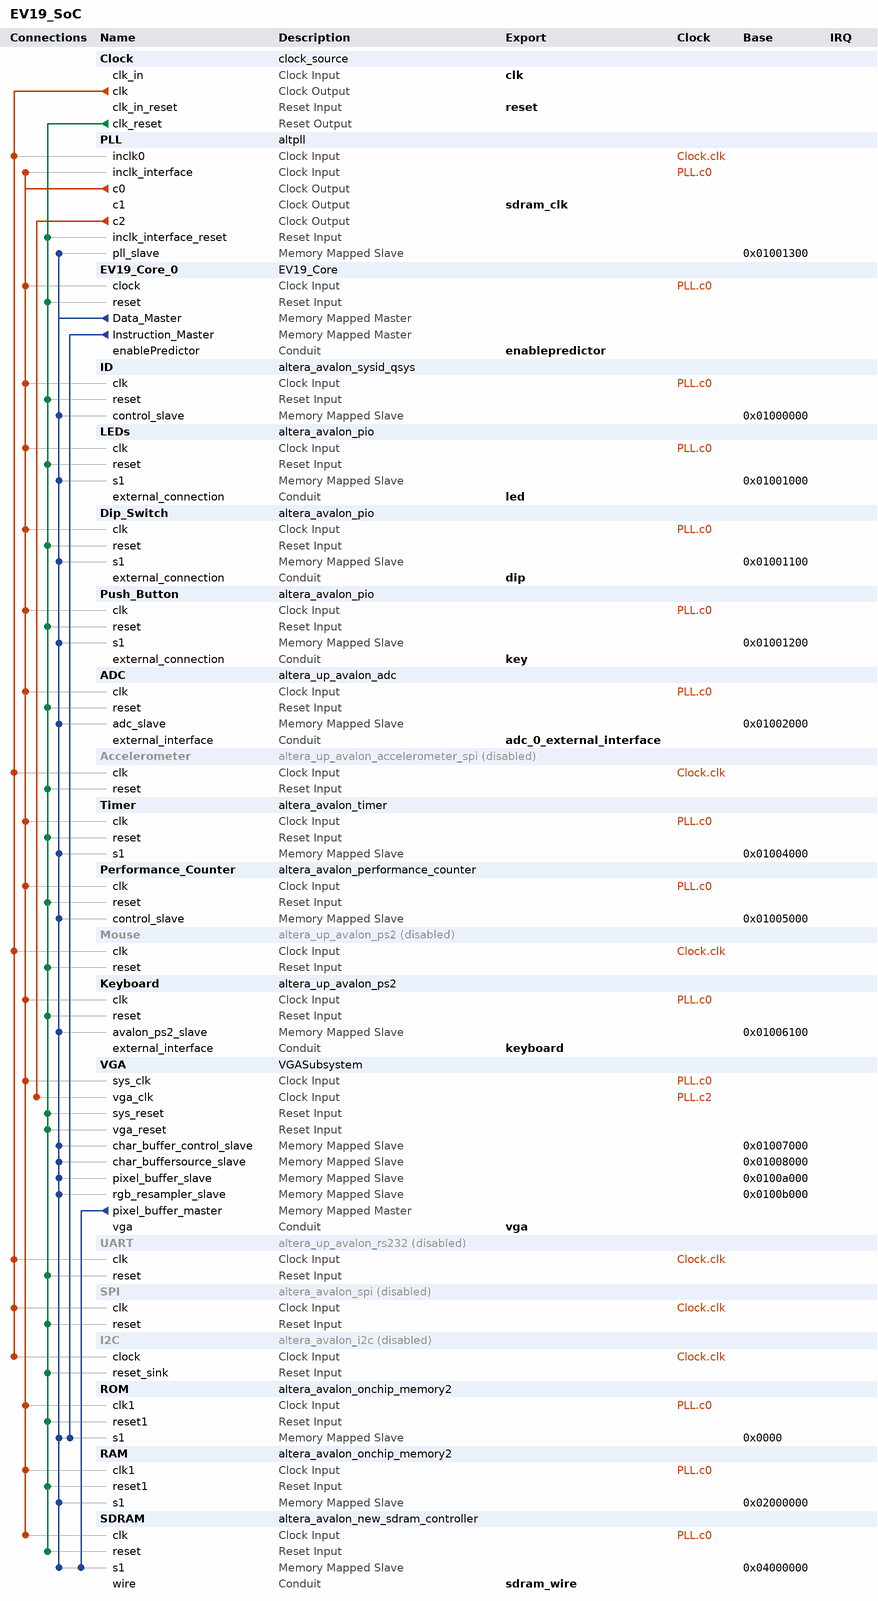
[diagram p0: system contents]
# Platform Designer (Qsys) system EV19_SoC, Cyclone IV E EP4CE22F17C6
# Parameters at their usual value, and those the tool derives, are not listed.
package require -exact qsys 18.1
create_system EV19_SoC
set_project_property DEVICE_FAMILY {Cyclone IV E}
set_project_property DEVICE EP4CE22F17C6

add_instance Clock clock_source 18.1
set_instance_parameter_value Clock clockFrequency 50000000

add_instance PLL altpll 18.1
set_instance_parameter_value PLL AVALON_USE_SEPARATE_SYSCLK YES
set_instance_parameter_value PLL CLK0_DIVIDE_BY 1
set_instance_parameter_value PLL CLK0_MULTIPLY_BY 1
set_instance_parameter_value PLL CLK1_DIVIDE_BY 1
set_instance_parameter_value PLL CLK1_DUTY_CYCLE 50
set_instance_parameter_value PLL CLK1_MULTIPLY_BY 1
set_instance_parameter_value PLL CLK1_PHASE_SHIFT -3000
set_instance_parameter_value PLL CLK2_DIVIDE_BY 2
set_instance_parameter_value PLL CLK2_DUTY_CYCLE 50
set_instance_parameter_value PLL CLK2_MULTIPLY_BY 1
set_instance_parameter_value PLL CLK2_PHASE_SHIFT 0
set_instance_parameter_value PLL INCLK0_INPUT_FREQUENCY 20000
set_instance_parameter_value PLL PORT_ARESET PORT_UNUSED
set_instance_parameter_value PLL PORT_LOCKED PORT_UNUSED
set_instance_parameter_value PLL PORT_clk1 PORT_USED
set_instance_parameter_value PLL PORT_clk2 PORT_USED
set_instance_parameter_value PLL PORT_clk3 PORT_UNUSED

add_instance EV19_Core_0 EV19_Core 1.0

add_instance ID altera_avalon_sysid_qsys 18.1
set_instance_parameter_value ID id 0

add_instance LEDs altera_avalon_pio 18.1
set_instance_parameter_value LEDs bitModifyingOutReg true
set_instance_parameter_value LEDs direction Output
set_instance_parameter_value LEDs width 8

add_instance Dip_Switch altera_avalon_pio 18.1
set_instance_parameter_value Dip_Switch direction Input
set_instance_parameter_value Dip_Switch width 4

add_instance Push_Button altera_avalon_pio 18.1
set_instance_parameter_value Push_Button direction Input
set_instance_parameter_value Push_Button width 1

add_instance ADC altera_up_avalon_adc 18.0
set_instance_parameter_value ADC board DE0-Nano
set_instance_parameter_value ADC numch_ 8
set_instance_parameter_value ADC sclk_freq 3.2

add_instance Accelerometer altera_up_avalon_accelerometer_spi 18.0
set_instance_property Accelerometer ENABLED false

add_instance Timer altera_avalon_timer 18.1
set_instance_parameter_value Timer period 1
set_instance_parameter_value Timer periodUnits MSEC

add_instance Performance_Counter altera_avalon_performance_counter 18.1
set_instance_parameter_value Performance_Counter numberOfSections 3

add_instance Mouse altera_up_avalon_ps2 18.0
set_instance_property Mouse ENABLED false

add_instance Keyboard altera_up_avalon_ps2 18.0

add_instance VGA VGASubsystem 1.0

add_instance UART altera_up_avalon_rs232 17.1
set_instance_property UART ENABLED false
set_instance_parameter_value UART baud 57600
set_instance_parameter_value UART parity None

add_instance SPI altera_avalon_spi 18.1
set_instance_property SPI ENABLED false
set_instance_parameter_value SPI clockPolarity 0
set_instance_parameter_value SPI dataWidth 8
set_instance_parameter_value SPI masterSPI true
set_instance_parameter_value SPI numberOfSlaves 1
set_instance_parameter_value SPI targetClockRate 128000

add_instance I2C altera_avalon_i2c 18.1
set_instance_property I2C ENABLED false
set_instance_parameter_value I2C FIFO_DEPTH 4

add_instance ROM altera_avalon_onchip_memory2 18.1
set_instance_parameter_value ROM allowInSystemMemoryContentEditor true
set_instance_parameter_value ROM dataWidth 32
set_instance_parameter_value ROM dualPort false
set_instance_parameter_value ROM initMemContent true
set_instance_parameter_value ROM initializationFileName ROM.mif
set_instance_parameter_value ROM instanceID ROM
set_instance_parameter_value ROM memorySize 16384
set_instance_parameter_value ROM useNonDefaultInitFile true
set_instance_parameter_value ROM writable false

add_instance RAM altera_avalon_onchip_memory2 18.1
set_instance_parameter_value RAM allowInSystemMemoryContentEditor true
set_instance_parameter_value RAM dataWidth 32
set_instance_parameter_value RAM dualPort false
set_instance_parameter_value RAM enableDiffWidth true
set_instance_parameter_value RAM initMemContent true
set_instance_parameter_value RAM initializationFileName RAM.mif
set_instance_parameter_value RAM instanceID RAM
set_instance_parameter_value RAM memorySize 4096
set_instance_parameter_value RAM resetrequest_enabled false
set_instance_parameter_value RAM useNonDefaultInitFile true

add_instance SDRAM altera_avalon_new_sdram_controller 18.1
set_instance_parameter_value SDRAM TAC 5.5
set_instance_parameter_value SDRAM TRCD 20.0
set_instance_parameter_value SDRAM TRP 20.0
set_instance_parameter_value SDRAM casLatency 3
set_instance_parameter_value SDRAM columnWidth 9
set_instance_parameter_value SDRAM dataWidth 16
set_instance_parameter_value SDRAM generateSimulationModel false
set_instance_parameter_value SDRAM model single_Micron_MT48LC4M32B2_7_chip
set_instance_parameter_value SDRAM numberOfBanks 4
set_instance_parameter_value SDRAM numberOfChipSelects 1
set_instance_parameter_value SDRAM powerUpDelay 100.0
set_instance_parameter_value SDRAM refreshPeriod 15.625
set_instance_parameter_value SDRAM rowWidth 13

# connections
add_connection Clock.clk Accelerometer.clk clock
add_connection Clock.clk I2C.clock clock
add_connection Clock.clk Mouse.clk clock
add_connection Clock.clk PLL.inclk0 clock
add_connection Clock.clk SPI.clk clock
add_connection Clock.clk UART.clk clock
add_connection PLL.c0 ADC.clk clock
add_connection PLL.c0 Dip_Switch.clk clock
add_connection PLL.c0 EV19_Core_0.clock clock
add_connection PLL.c0 ID.clk clock
add_connection PLL.c0 Keyboard.clk clock
add_connection PLL.c0 LEDs.clk clock
add_connection PLL.c0 Performance_Counter.clk clock
add_connection PLL.c0 PLL.inclk_interface clock
add_connection PLL.c0 Push_Button.clk clock
add_connection PLL.c0 RAM.clk1 clock
add_connection PLL.c0 ROM.clk1 clock
add_connection PLL.c0 SDRAM.clk clock
add_connection PLL.c0 Timer.clk clock
add_connection PLL.c0 VGA.sys_clk clock
add_connection PLL.c2 VGA.vga_clk clock
add_connection Clock.clk_reset Accelerometer.reset reset
add_connection Clock.clk_reset ADC.reset reset
add_connection Clock.clk_reset Dip_Switch.reset reset
add_connection Clock.clk_reset EV19_Core_0.reset reset
add_connection Clock.clk_reset I2C.reset_sink reset
add_connection Clock.clk_reset ID.reset reset
add_connection Clock.clk_reset Keyboard.reset reset
add_connection Clock.clk_reset LEDs.reset reset
add_connection Clock.clk_reset Mouse.reset reset
add_connection Clock.clk_reset Performance_Counter.reset reset
add_connection Clock.clk_reset PLL.inclk_interface_reset reset
add_connection Clock.clk_reset Push_Button.reset reset
add_connection Clock.clk_reset RAM.reset1 reset
add_connection Clock.clk_reset ROM.reset1 reset
add_connection Clock.clk_reset SDRAM.reset reset
add_connection Clock.clk_reset SPI.reset reset
add_connection Clock.clk_reset Timer.reset reset
add_connection Clock.clk_reset UART.reset reset
add_connection Clock.clk_reset VGA.sys_reset reset
add_connection Clock.clk_reset VGA.vga_reset reset
add_connection EV19_Core_0.Data_Master ADC.adc_slave avalon
set_connection_parameter_value EV19_Core_0.Data_Master/ADC.adc_slave baseAddress 0x01002000
add_connection EV19_Core_0.Data_Master Dip_Switch.s1 avalon
set_connection_parameter_value EV19_Core_0.Data_Master/Dip_Switch.s1 baseAddress 0x01001100
add_connection EV19_Core_0.Data_Master ID.control_slave avalon
set_connection_parameter_value EV19_Core_0.Data_Master/ID.control_slave baseAddress 0x01000000
add_connection EV19_Core_0.Data_Master Keyboard.avalon_ps2_slave avalon
set_connection_parameter_value EV19_Core_0.Data_Master/Keyboard.avalon_ps2_slave baseAddress 0x01006100
add_connection EV19_Core_0.Data_Master LEDs.s1 avalon
set_connection_parameter_value EV19_Core_0.Data_Master/LEDs.s1 baseAddress 0x01001000
add_connection EV19_Core_0.Data_Master Performance_Counter.control_slave avalon
set_connection_parameter_value EV19_Core_0.Data_Master/Performance_Counter.control_slave baseAddress 0x01005000
add_connection EV19_Core_0.Data_Master PLL.pll_slave avalon
set_connection_parameter_value EV19_Core_0.Data_Master/PLL.pll_slave baseAddress 0x01001300
add_connection EV19_Core_0.Data_Master Push_Button.s1 avalon
set_connection_parameter_value EV19_Core_0.Data_Master/Push_Button.s1 baseAddress 0x01001200
add_connection EV19_Core_0.Data_Master RAM.s1 avalon
set_connection_parameter_value EV19_Core_0.Data_Master/RAM.s1 baseAddress 0x02000000
add_connection EV19_Core_0.Data_Master ROM.s1 avalon
set_connection_parameter_value EV19_Core_0.Data_Master/ROM.s1 baseAddress 0x0000
add_connection EV19_Core_0.Data_Master SDRAM.s1 avalon
set_connection_parameter_value EV19_Core_0.Data_Master/SDRAM.s1 baseAddress 0x04000000
add_connection EV19_Core_0.Data_Master Timer.s1 avalon
set_connection_parameter_value EV19_Core_0.Data_Master/Timer.s1 baseAddress 0x01004000
add_connection EV19_Core_0.Data_Master VGA.char_buffer_control_slave avalon
set_connection_parameter_value EV19_Core_0.Data_Master/VGA.char_buffer_control_slave baseAddress 0x01007000
add_connection EV19_Core_0.Data_Master VGA.char_buffersource_slave avalon
set_connection_parameter_value EV19_Core_0.Data_Master/VGA.char_buffersource_slave baseAddress 0x01008000
add_connection EV19_Core_0.Data_Master VGA.pixel_buffer_slave avalon
set_connection_parameter_value EV19_Core_0.Data_Master/VGA.pixel_buffer_slave baseAddress 0x0100a000
add_connection EV19_Core_0.Data_Master VGA.rgb_resampler_slave avalon
set_connection_parameter_value EV19_Core_0.Data_Master/VGA.rgb_resampler_slave baseAddress 0x0100b000
add_connection EV19_Core_0.Instruction_Master ROM.s1 avalon
set_connection_parameter_value EV19_Core_0.Instruction_Master/ROM.s1 baseAddress 0x0000
add_connection VGA.pixel_buffer_master SDRAM.s1 avalon
set_connection_parameter_value VGA.pixel_buffer_master/SDRAM.s1 baseAddress 0x04000000

# exported interfaces
add_interface adc_0_external_interface conduit end
set_interface_property adc_0_external_interface EXPORT_OF ADC.external_interface
add_interface clk clock sink
set_interface_property clk EXPORT_OF Clock.clk_in
add_interface dip conduit end
set_interface_property dip EXPORT_OF Dip_Switch.external_connection
add_interface enablepredictor conduit end
set_interface_property enablepredictor EXPORT_OF EV19_Core_0.enablePredictor
add_interface key conduit end
set_interface_property key EXPORT_OF Push_Button.external_connection
add_interface keyboard conduit end
set_interface_property keyboard EXPORT_OF Keyboard.external_interface
add_interface led conduit end
set_interface_property led EXPORT_OF LEDs.external_connection
add_interface reset reset sink
set_interface_property reset EXPORT_OF Clock.clk_in_reset
add_interface sdram_clk clock source
set_interface_property sdram_clk EXPORT_OF PLL.c1
add_interface sdram_wire conduit end
set_interface_property sdram_wire EXPORT_OF SDRAM.wire
add_interface vga conduit end
set_interface_property vga EXPORT_OF VGA.vga

set_interconnect_requirement {$system} qsys_mm.clockCrossingAdapter HANDSHAKE
set_interconnect_requirement {$system} qsys_mm.enableEccProtection FALSE
set_interconnect_requirement {$system} qsys_mm.enableInstrumentation FALSE
set_interconnect_requirement {$system} qsys_mm.insertDefaultSlave FALSE
set_interconnect_requirement {$system} qsys_mm.maxAdditionalLatency 1

save_system EV19_SoC.qsys
